# Altium schematic sheet Shield_Pi_Xbee.SchDoc
size A4
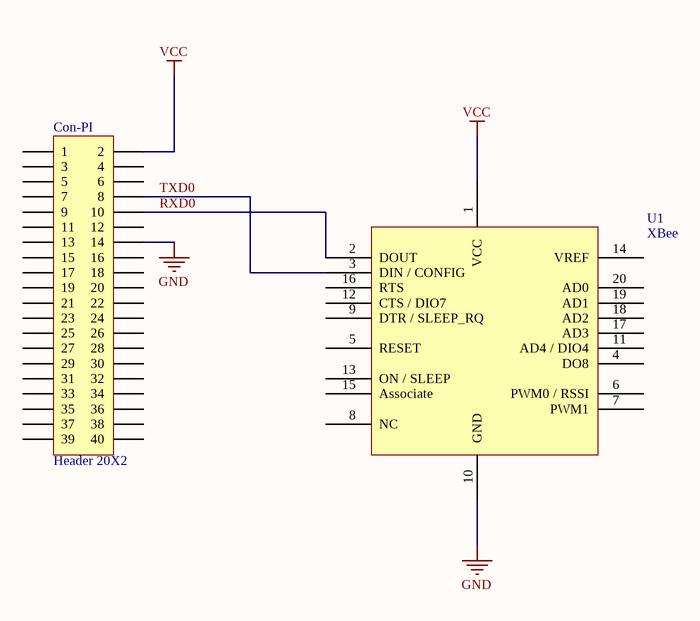
[diagram p0: Shield_Pi_Xbee.SchDoc]

## Parts
Con-PI  Header 20X2  [HDR2X20]
U1  XBee  [XBee]

## Nets
GND: Con-PI.14 U1.10(GND)
VCC: Con-PI.2 U1.1(VCC)
RXD0: Con-PI.10 U1.2(DOUT)
TXD0: Con-PI.8 U1.3(DIN_/_CONFIG)

Not connected (* = marked no-connect by the designer): Con-PI 1 3 4 5 6 7 9 11 12 13 15 16 17 18 19 20 21 22 23 24 25 26 27 28 29 30 31 32 33 34 35 36 37 38 39 40; U1 4(DO8) 5(RESET) 6(PWM0_/_RSSI) 7(PWM1) 8(NC) 9(DTR_/_SLEEP_RQ) 11(AD4_/_DIO4) 12(CTS_/_DIO7) 13(ON_/_SLEEP) 14(VREF) 15(Associate) 16(RTS) 17(AD3) 18(AD2) 19(AD1) 20(AD0)

## Library data of the parts
Con-PI = Header 20X2: Header, 20-Pin, Dual row; LatestRevisionDate: 17-Jul-2002; LatestRevisionNote: Re-released for DXP Platform.; Publisher: Altium Limited
U1 = XBee: Xbee RF transceiver from Digi